# EAGLE design WiiMouseSchematicRev1 (EAGLE 5.07)

## Sheet 1 of 2
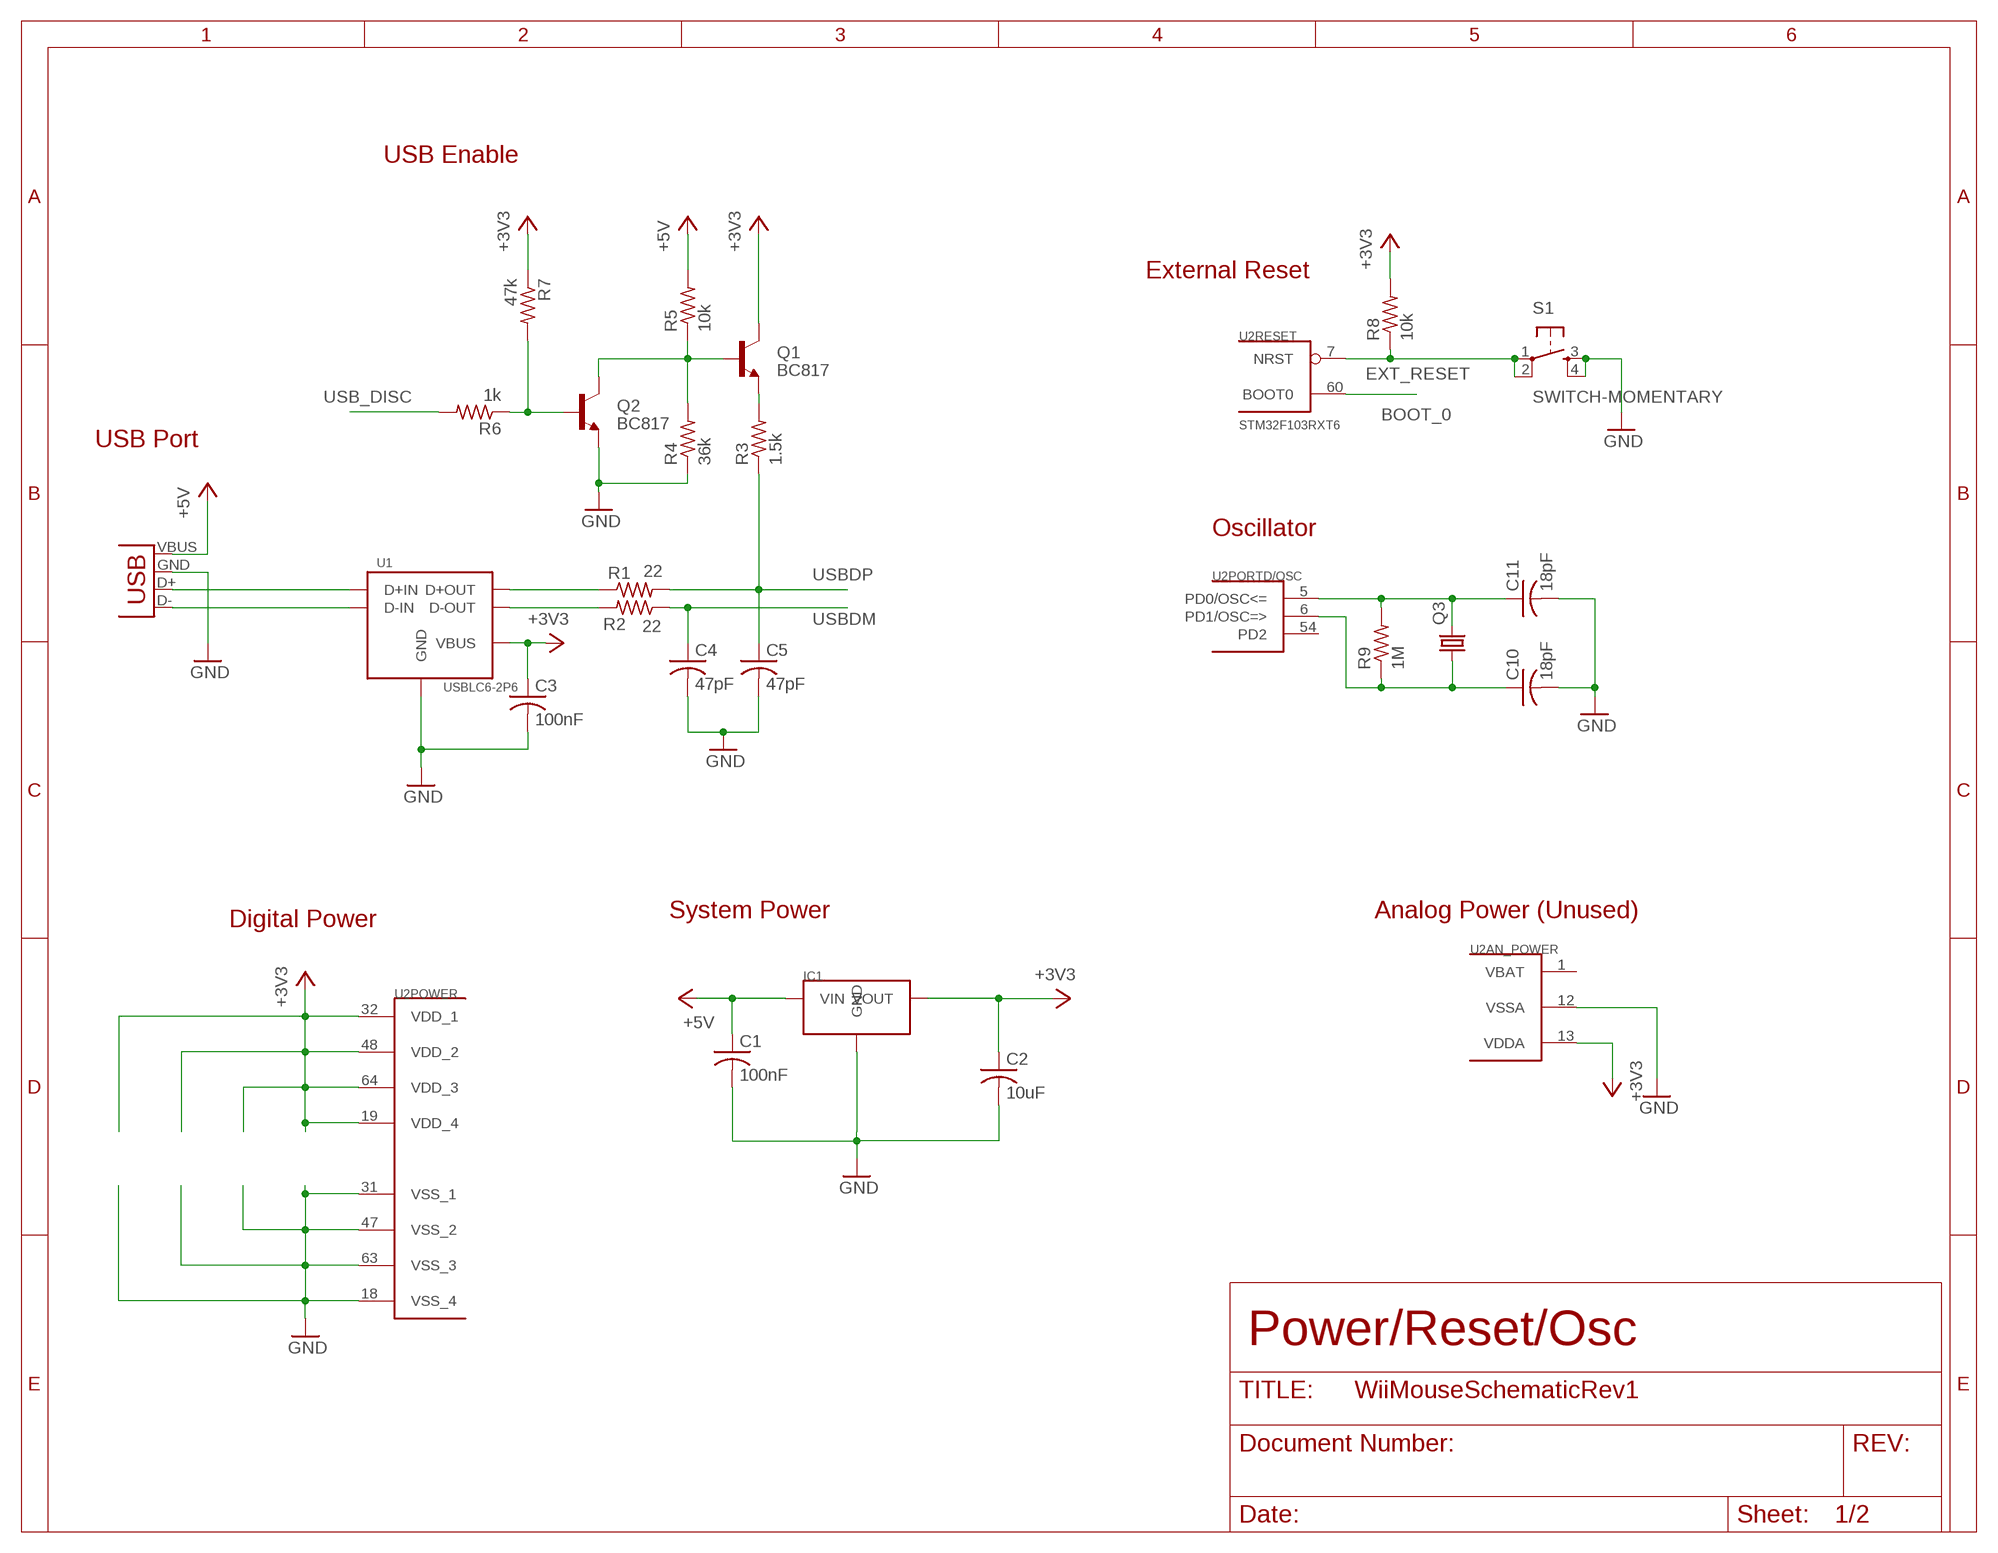
[diagram p0: schematic, sheet 1]

### Parts
C1  100nF  C-USC1206  [C1206]
C2  10uF  C-USC1206  [C1206]
C3  100nF  C-USC1206  [C1206]
C4  47pF  C-USC1206  [C1206]
C5  47pF  C-USC1206  [C1206]
C10  18pF  C-USC1206  [C1206]
C11  18pF  C-USC1206  [C1206]
IC1  LD1117  [SOT-223]
Q1  BC817  TRANSISTOR_NPNSOT23  [SOT23]
Q2  BC817  TRANSISTOR_NPNSOT23  [SOT23]
Q3  CRYSTALHC49UP  [HC49UP]
R1  22  R-US_M1206  [M1206]
R2  22  R-US_M1206  [M1206]
R3  1.5k  R-US_M1206  [M1206]
R4  36k  R-US_M1206  [M1206]
R5  10k  R-US_M1206  [M1206]
R6  1k  R-US_M1206  [M1206]
R7  47k  R-US_M1206  [M1206]
R8  10k  R-US_M1206  [M1206]
R9  1M  R-US_M1206  [M1206]
S1  SWITCH-MOMENTARY  [PUSH-BTN]
U1  USBLC6-2P6  [SOT-666]
U2  STM32F103RXT6  STM32F10XRXT6  [TQFP64]
X1  USB-A-H  [USB-A-H]

### Nets
+3V3: C2.1 C3.1 IC1.2(VOUT) Q1.3(C) R7.1 R8.2 U1.P$5(VBUS) U2.13(AN_POWER:VDDA) U2.19(POWER:VDD_4) U2.32(POWER:VDD_1) U2.48(POWER:VDD_2) U2.64(POWER:VDD_3) ; also sheet 2
+5V: C1.1 IC1.3(VIN) R5.2 X1.VBUS(GND)
BOOT_0: U2.60(RESET:BOOT0) ; also sheet 2
EXT_RESET: R8.1 S1.1 S1.2 U2.7(RESET:NRST)
GND: C1.2 C2.2 C3.2 C4.2 C5.2 C10.2 C11.2 IC1.1(GND) Q2.2(E) R4.1 S1.3 S1.4 U1.P$2(GND) U2.12(AN_POWER:VSSA) U2.18(POWER:VSS_4) U2.31(POWER:VSS_1) U2.47(POWER:VSS_2) U2.63(POWER:VSS_3) X1.GND(VBUS) ; also sheet 2
N$2: U1.P$3(D-IN) X1.D-(D+)
N$3: U1.P$1(D+IN) X1.D+(D-)
N$5: R1.1 U1.P$6(D+OUT)
N$6: R2.2 U1.P$4(D-OUT)
N$7: Q1.1(B) Q2.3(C) R4.2 R5.1
N$8: Q2.1(B) R6.1 R7.2
N$9: Q1.2(E) R3.2
N$10: C11.1 Q3.2 R9.2 U2.5(PORTD/OSC:PD0/OSC<=)
N$12: C10.1 Q3.1 R9.1 U2.6(PORTD/OSC:PD1/OSC=>)
USB_DISC: R6.2 ; also sheet 2
USBDM: C4.1 R2.1
USBDP: C5.1 R1.2 R3.1
Unconnected: U2.54(PORTD/OSC:PD2)

### Notes on the sheet
- USB Enable
- External Reset
- USB Port
- Oscillator
- System Power | Analog Power (Unused)
- Digital Power
- Power/Reset/Osc

## Sheet 2 of 2
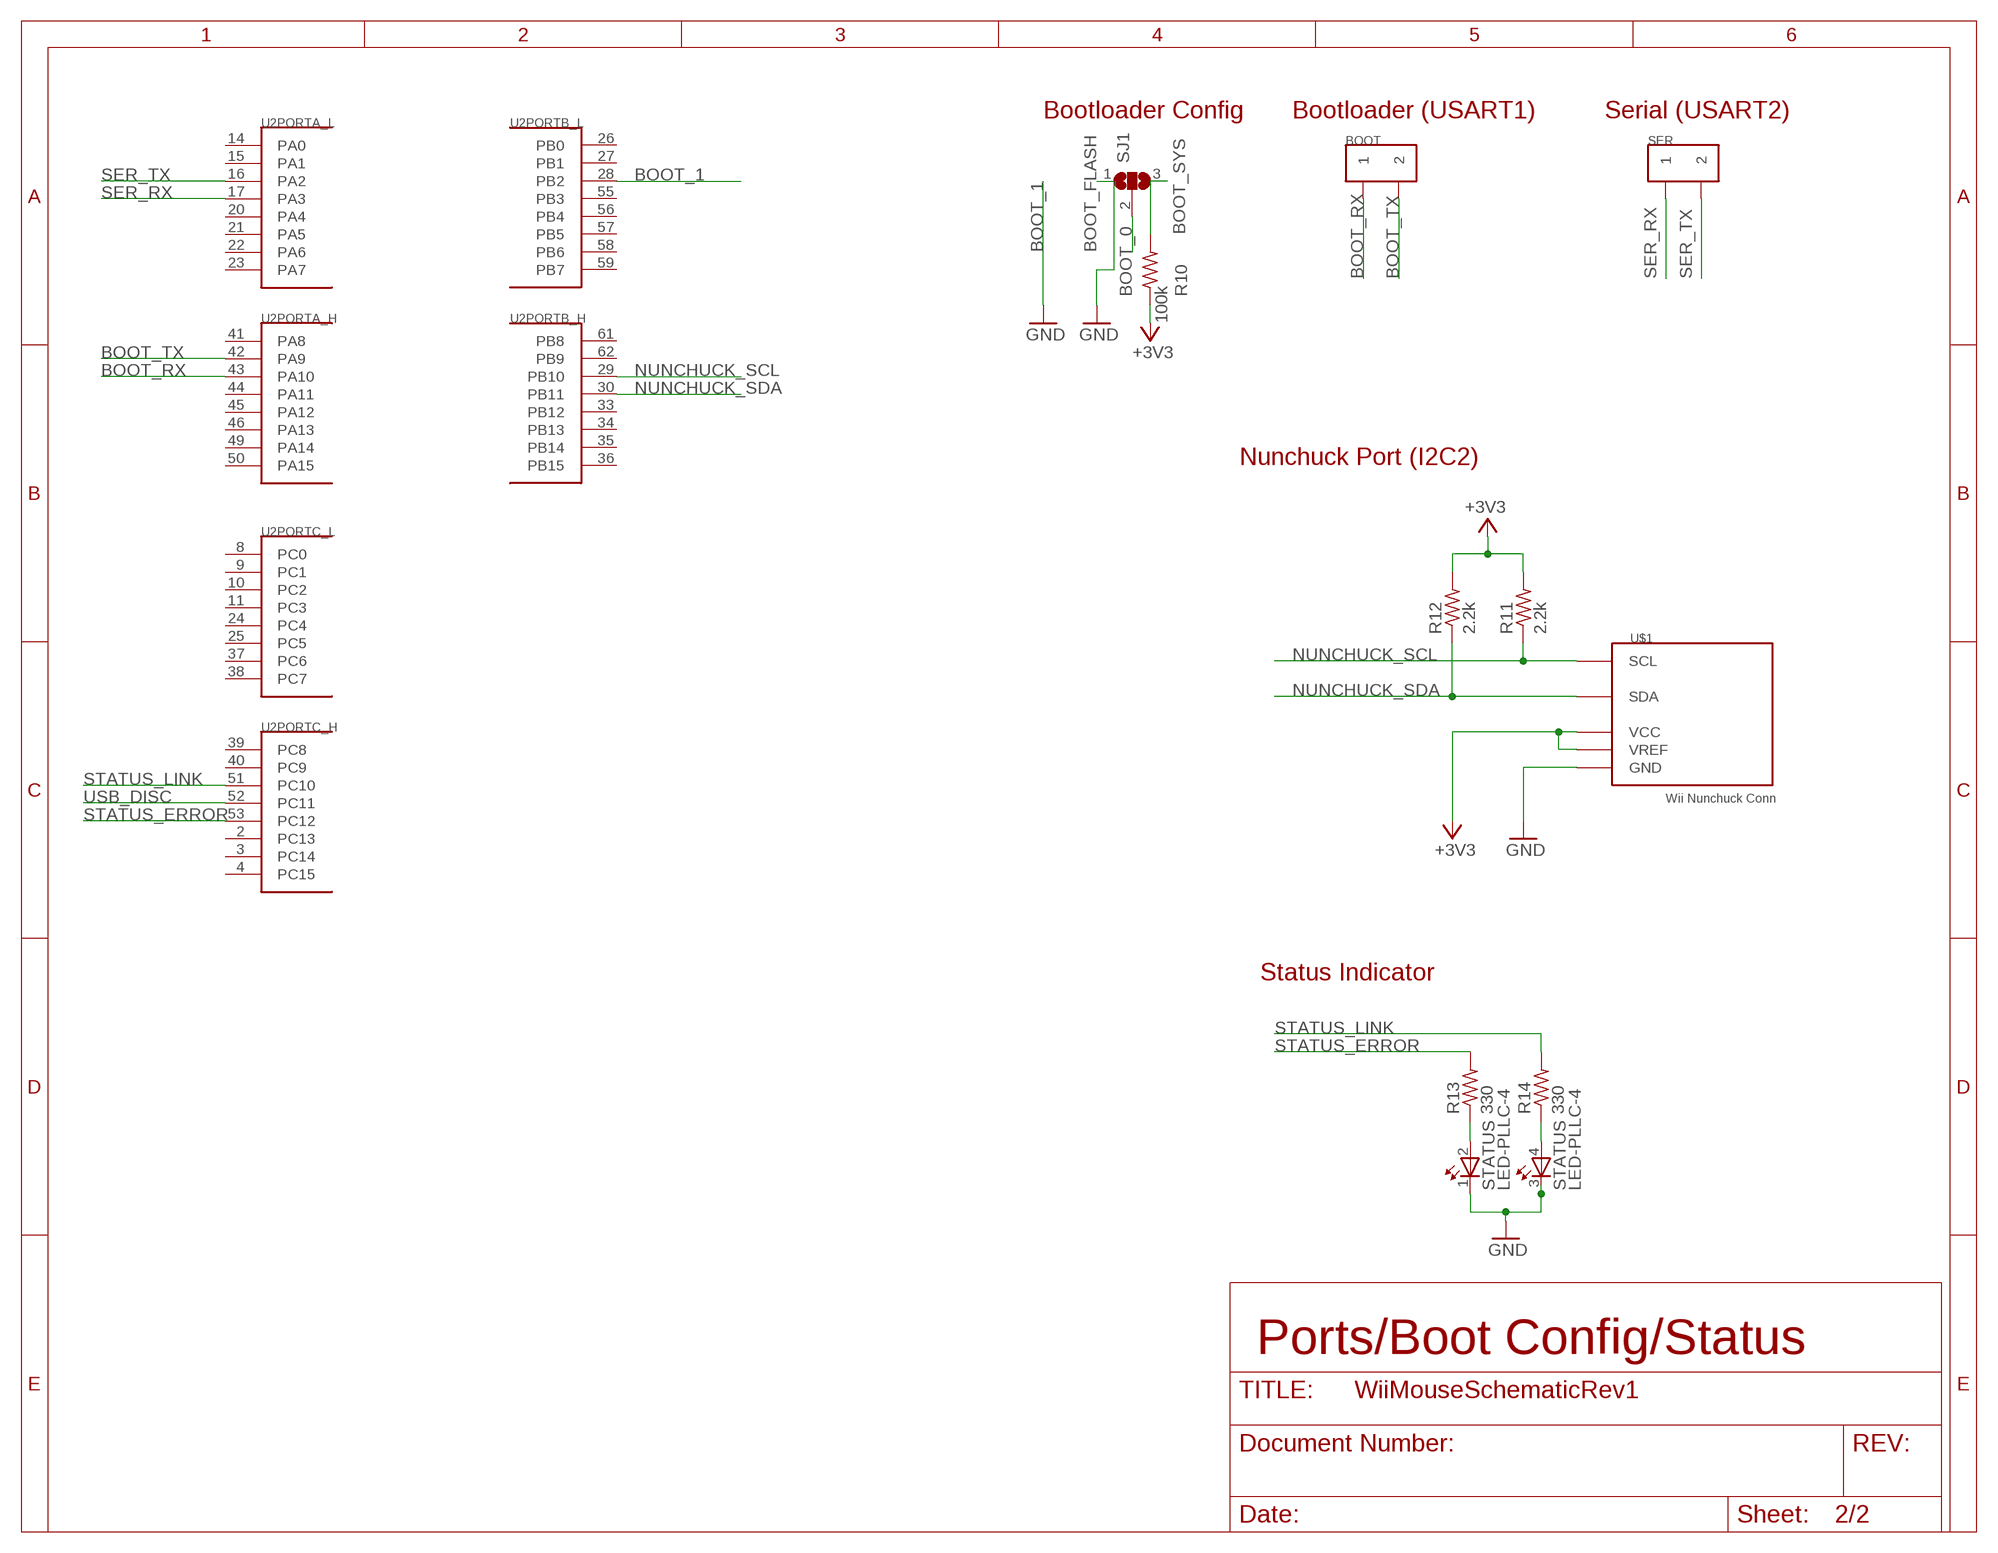
[diagram p1: schematic, sheet 2]

### Parts
BOOT  JUMPER-2-SMD  [JUMPER-2-SMD]
R10  100k  R-US_M1206  [M1206]
R11  2.2k  R-US_M1206  [M1206]
R12  2.2k  R-US_M1206  [M1206]
R13  330  R-US_M1206  [M1206]
R14  330  R-US_M1206  [M1206]
SER  JUMPER-2-SMD  [JUMPER-2-SMD]
SJ1  SJ2WW  [SJ_2W]
STATUS  LED-PLLC-4  [LED-PLCC-4]
U$1  WII-NUNCHUCK  [CONN-WII-MOUSE]

### Nets
+3V3: R10.1 R11.2 R12.2 U$1.REF_POS(VREF) U$1.VCC ; also sheet 1
BOOT_0: SJ1.2 ; also sheet 1
BOOT_1: U2.28(PORTB_L:PB2) ; supply symbol labelled GND
BOOT_RX: BOOT.P$1 U2.43(PORTA_H:PA10)
BOOT_TX: BOOT.P$2 U2.42(PORTA_H:PA9)
GND: SJ1.1 STATUS.1 STATUS.3 U$1.GND ; also sheet 1
N$1: R13.1 STATUS.2
N$4: R14.1 STATUS.4
N$11: R10.2 SJ1.3
NUNCHUCK_SCL: R11.1 U2.29(PORTB_H:PB10) U$1.SCL
NUNCHUCK_SDA: R12.1 U2.30(PORTB_H:PB11) U$1.SDA
SER_RX: SER.P$1 U2.17(PORTA_L:PA3)
SER_TX: SER.P$2 U2.16(PORTA_L:PA2)
STATUS_ERROR: R13.2 U2.53(PORTC_H:PC12)
STATUS_LINK: R14.2 U2.51(PORTC_H:PC10)
USB_DISC: U2.52(PORTC_H:PC11) ; also sheet 1
Unconnected: U2.2(PORTC_H:PC13) U2.3(PORTC_H:PC14) U2.4(PORTC_H:PC15) U2.8(PORTC_L:PC0) U2.9(PORTC_L:PC1) U2.10(PORTC_L:PC2) U2.11(PORTC_L:PC3) U2.14(PORTA_L:PA0) U2.15(PORTA_L:PA1) U2.20(PORTA_L:PA4) U2.21(PORTA_L:PA5) U2.22(PORTA_L:PA6) U2.23(PORTA_L:PA7) U2.24(PORTC_L:PC4) U2.25(PORTC_L:PC5) U2.26(PORTB_L:PB0) U2.27(PORTB_L:PB1) U2.33(PORTB_H:PB12) U2.34(PORTB_H:PB13) U2.35(PORTB_H:PB14) U2.36(PORTB_H:PB15) U2.37(PORTC_L:PC6) U2.38(PORTC_L:PC7) U2.39(PORTC_H:PC8) U2.40(PORTC_H:PC9) U2.41(PORTA_H:PA8) U2.44(PORTA_H:PA11) U2.45(PORTA_H:PA12) U2.46(PORTA_H:PA13) U2.49(PORTA_H:PA14) U2.50(PORTA_H:PA15) U2.55(PORTB_L:PB3) U2.56(PORTB_L:PB4) U2.57(PORTB_L:PB5) U2.58(PORTB_L:PB6) U2.59(PORTB_L:PB7) U2.61(PORTB_H:PB8) U2.62(PORTB_H:PB9)

### Notes on the sheet
- Serial (USART2)
- Bootloader Config | Bootloader (USART1)
- BOOT_SYS
- BOOT_FLASH
- Nunchuck Port (I2C2)
- Status Indicator
- Ports/Boot Config/Status

## Power pins joined to a net without a drawn wire
VBAT: U2.1(AN_POWER:VBAT)

## Library data of the parts
BOOT SER = parts_library:JUMPER-2-SMD
C1-C5 C10 C11 = rcl:C-US: CAPACITOR, American symbol
IC1 = parts_library:LD1117
Q1 Q2 = SparkFun:TRANSISTOR_NPN: Transistor NPN BJT configuration in SOT23 package. MMBT2222 is the common NPN we use. Double check BCE configuration again layout.
Q3 = crystal:CRYSTAL: CRYSTAL; OC_FARNELL: unknown; OC_NEWARK: unknown
R1-R14 = resistor:R-US_: RESISTOR, American symbol
S1 = parts_library:SWITCH-MOMENTARY
SJ1 = jumper:SJ2W: SMD solder JUMPER
STATUS = parts_library:LED-PLLC-4
U1 = parts_library:USBLC6-2P6
U2 = stm32:STM32F10XRXT6: STM32F101/103 64pin LQFP
U$1 = parts_library:WII-NUNCHUCK
X1 = SparkFun:USB: USB Connectors USB-B-PTH is fully proven SKU : PRT-00139 USB-miniB is fully proven SKU : PRT-00587 USB-A-PCB is untested. USB-A-H is throughly reviewed, but untested. Spark Fun Electronics SKU : PRT-00437 USB-B-SMT is throughly reviewed, but untested. Needs silkscreen touching up. USB-A-S has not been used/tested USB-MB-H has not been used/tested

## Board
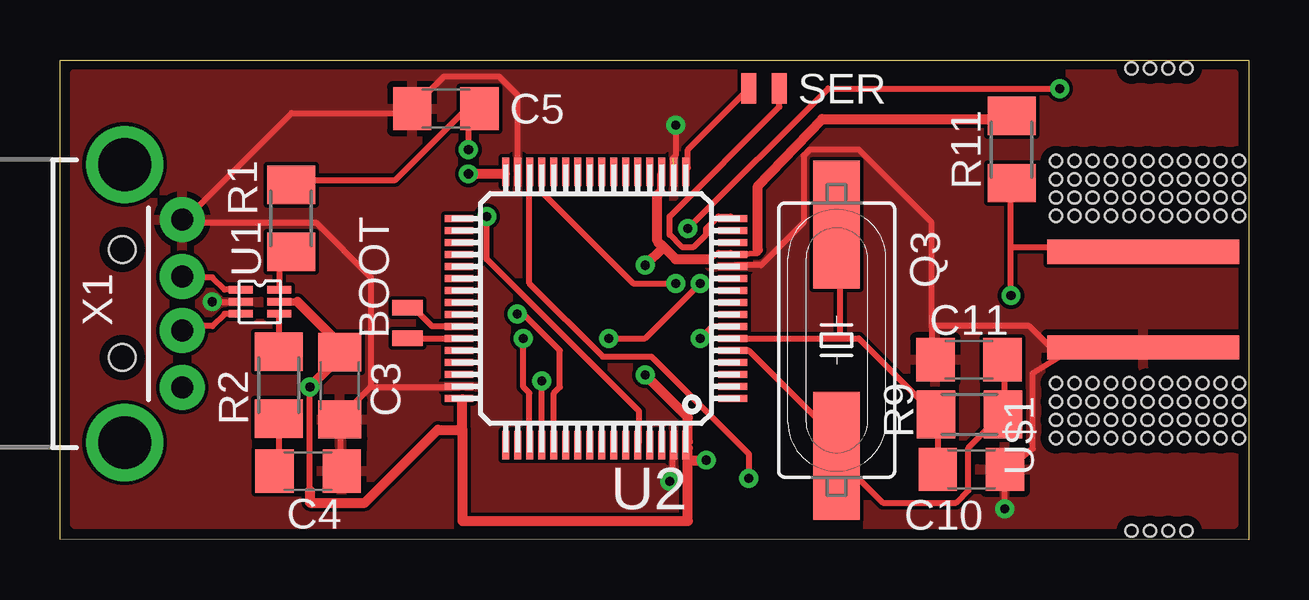
[diagram p2: board, top side]
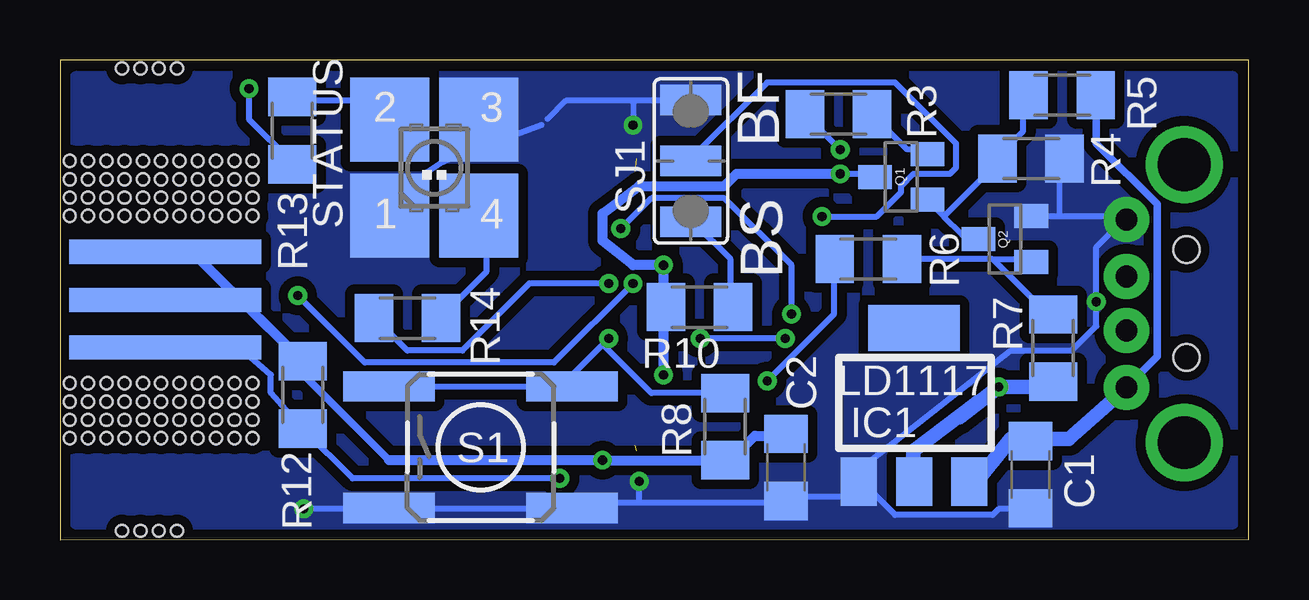
[diagram p3: board, bottom side, seen from below]

Size 49.53 x 20.02 mm. Coordinates in mm from the lower left corner, seen from the top.
Outline: 0,0.03 0,20.02 49.53,20.02 49.53,0 0,0.03
Copper layers (1*16): Top 0.0356mm / dielectric 1.5011mm / Bottom 0.0356mm
Design rules "typical_4pcb *": minimum track width 10mil, minimum drill 15mil, track to track 6mil, track to pad 6mil, pad to pad 6mil, via to via 6mil, smd to smd 6mil, copper to edge 15mil, drill to drill 10mil, minimum pad ring 10mil, minimum via ring 8mil, stop-mask expansion 4mil, vias tented up to drill 0mil, thermal gap 10mil

### Footprints (pad centres in the part's own frame; a part is rotated, then mirrored left to right if it is on the bottom)
JUMPER-2-SMD = smd 0.635 x 1.27: P$1 -1.27,0; P$2 0,0
C1206 = smd 1.6 x 1.8: 1 -1.4,0; 2 1.4,0
SOT-223 = smd 1.499 x 2.007: 1 -2.3,-3.235; 2 0,-3.235; 3 2.3,-3.235 | smd 3.81 x 1.93: 4 0,3.175
SOT23 = smd 1 x 1.4: 1 -0.95,-1.1; 2 0.95,-1.1; 3 0,1.1
HC49UP = smd 5.334 x 1.93: 1 -4.826,0; 2 4.826,0
M1206 = smd 1.6 x 2: 1 -1.4,0; 2 1.4,0
PUSH-BTN = smd 3.81 x 1.27: 1 -3.81,2.54; 2 3.81,2.54; 3 -3.81,-2.54; 4 3.81,-2.54
SJ_2W = smd 1.27 x 2.54: 1 -2.54,0; 2 0,0; 3 2.54,0
LED-PLCC-4 = smd 3.3 x 3.5: 1 -1.85,-2; 2 -1.85,2; 3 1.85,2; 4 1.85,-2
SOT-666 = smd 0.3 x 0.991: P$1 0.5,0.805; P$2 0,0.805; P$3 -0.5,0.805; P$4 -0.5,-0.805; P$5 0,-0.805; P$6 0.5,-0.805
TQFP64 = smd 1.2 x 0.3: 1 -5.7,3.75; 2 -5.7,3.25; 3 -5.7,2.75; 4 -5.7,2.25; 5 -5.7,1.75; 6 -5.7,1.25; 7 -5.7,0.75; 8 -5.7,0.25; 9 -5.7,-0.25; 10 -5.7,-0.75; 11 -5.7,-1.25; 12 -5.7,-1.75; 13 -5.7,-2.25; 14 -5.7,-2.75; 15 -5.7,-3.25; 16 -5.7,-3.75; 33 5.7,-3.75; 34 5.7,-3.25; 35 5.7,-2.75; 36 5.7,-2.25; 37 5.7,-1.75; 38 5.7,-1.25; 39 5.7,-0.75; 40 5.7,-0.25; 41 5.7,0.25; 42 5.7,0.75; 43 5.7,1.25; 44 5.7,1.75; 45 5.7,2.25; 46 5.7,2.75; 47 5.7,3.25; 48 5.7,3.75 | smd 0.3 x 1.2: 17 -3.75,-5.7; 18 -3.25,-5.7; 19 -2.75,-5.7; 20 -2.25,-5.7; 21 -1.75,-5.7; 22 -1.25,-5.7; 23 -0.75,-5.7; 24 -0.25,-5.7; 25 0.25,-5.7; 26 0.75,-5.7; 27 1.25,-5.7; 28 1.75,-5.7; 29 2.25,-5.7; 30 2.75,-5.7; 31 3.25,-5.7; 32 3.75,-5.7; 49 3.75,5.7; 50 3.25,5.7; 51 2.75,5.7; 52 2.25,5.7; 53 1.75,5.7; 54 1.25,5.7; 55 0.75,5.7; 56 0.25,5.7; 57 -0.25,5.7; 58 -0.75,5.7; 59 -1.25,5.7; 60 -1.75,5.7; 61 -2.25,5.7; 62 -2.75,5.7; 63 -3.25,5.7; 64 -3.75,5.7
CONN-WII-MOUSE = smd 1.016 x 8.001: GND 11.989,-4.394; SCL 8.001,-4.394 | smd 0.991 x 8.001 bottom: REF_POS 10.008,-4.394 | smd 1.016 x 8.001 bottom: SDA 11.989,-4.394; VCC 8.001,-4.394 | hole 0.5: 5.74,-0.406; 6.502,-0.406; 0.356,-2.591; 0.356,-4.877; 0.356,-3.353; 0.356,-4.115; 4.978,-0.406; 4.216,-0.406; 5.74,-1.168; 6.502,-1.168; 4.978,-1.168; 4.216,-1.168; 5.74,-1.93; 6.502,-1.93; 4.978,-1.93; 4.216,-1.93; 5.74,-2.692; 6.502,-2.692; 4.978,-2.692; 4.216,-2.692; 5.74,-3.454; 6.502,-3.454; 4.978,-3.454; 4.216,-3.454; 5.74,-4.216; 6.502,-4.216; 4.978,-4.216; 4.216,-4.216; 5.74,-4.978; 6.502,-4.978; 4.978,-4.978; 4.216,-4.978; 5.74,-5.74; 6.502,-5.74; 4.978,-5.74; 4.216,-5.74; 5.74,-6.502; 6.502,-6.502; 4.978,-6.502; 4.216,-6.502; 5.74,-7.264; 6.502,-7.264; 4.978,-7.264; 4.216,-7.264; 5.74,-8.026; 6.502,-8.026; 4.978,-8.026; 4.216,-8.026; 15.011,-0.406; 15.773,-0.406; 14.249,-0.406; 13.487,-0.406; 15.011,-1.168; 15.773,-1.168; 14.249,-1.168; 13.487,-1.168; 15.011,-1.93; 15.773,-1.93; 14.249,-1.93; 13.487,-1.93; 15.011,-2.692; 15.773,-2.692; 14.249,-2.692; 13.487,-2.692; 15.011,-3.454; 15.773,-3.454; 14.249,-3.454; 13.487,-3.454; 15.011,-4.216; 15.773,-4.216; 14.249,-4.216; 13.487,-4.216; 15.011,-4.978; 15.773,-4.978; 14.249,-4.978; 13.487,-4.978; 15.011,-5.74; 15.773,-5.74; 14.249,-5.74; 13.487,-5.74; 15.011,-6.502; 15.773,-6.502; 14.249,-6.502; 13.487,-6.502; 15.011,-7.264; 15.773,-7.264; 14.249,-7.264; 13.487,-7.264; 15.011,-8.026; 15.773,-8.026; 14.249,-8.026; 13.487,-8.026; 19.634,-2.591; 19.634,-4.877; 19.634,-3.353; 19.634,-4.115
USB-A-H = drill 0.914 pad 1.88 round: D+ 2.4,1.127; D- 2.4,-1.127; GND 2.4,3.5; VBUS 2.4,-3.5 | drill 2.2 round: GND2 0,-5.8; GND3 0,5.8 | hole 1.1: -0.1,2.25; -0.1,-2.25

### Placement (x,y rotation side)
BOOT  14.48,9.68 90 top
C1  9.09,2.72 270 bottom
C2  19.28,3.02 270 bottom
C3  11.66,6.43 270 top
C4  10.34,2.87 0 top
C5  16.08,17.98 180 top
C10  37.97,2.95 0 top
C11  37.87,7.52 180 top
IC1  13.94,5.66 0 bottom
Q1  14.48,15.14 90 bottom
Q2  10.16,12.55 90 bottom
Q3  32.36,8.33 270 top
R1  9.63,13.41 90 top
R2  9.12,6.45 90 top
R3  17.09,17.75 0 bottom
R4  9.07,15.9 180 bottom
R5  7.77,18.54 0 bottom
R6  15.85,11.71 180 bottom
R7  8.15,8 90 bottom
R8  21.82,4.72 270 bottom
R9  37.9,5.23 0 top
R10  22.89,9.7 0 bottom
R11  39.65,16.28 90 top
R12  39.42,6.05 90 bottom
R13  39.85,17.07 270 bottom
R14  35.05,9.25 180 bottom
S1  32,3.86 0 bottom
SER  29.97,18.82 0 top
SJ1  23.24,15.8 270 bottom
STATUS  33.93,15.52 0 bottom
U1  8.33,9.93 90 top
U2  22.33,9.65 180 top
U$1  49.53,20.02 270 top
X1  2.69,9.86 0 top

### Tracks (layer width: path | path; a pad name or v marks a point on that pad's centre or on a via)
+3V3  (via drill 0.38)
  Top 0.254: 18.54,15.27 U2.32 | 25.02,14.5 25.02,15.27 U2.19 | 27.05,11.71 27.43,11.96 27.94,11.96 U2.13 29.08,11.96 29.08,12.09 | 39.62,17.55 R11.2 | 26.16,3.84 U2.64 | 16.76,5.87 U2.48 | 11.43,8.41 11.43,7.9 C3.1 11.68,7.65 | 10.41,2.06 v10.41,6.38
  Top 0.305: 9.91,9.93 U1.P$5 | U2.64 26.16,4.09
  Top 0.406: v17.02,15.27 18.54,15.27 | 25.02,14.5 24.89,14.38 24.89,12.47 25.15,12.22 | 25.15,12.22 25.65,11.71 27.05,11.71 | v24.38,11.46 25.15,12.22 | 39.62,17.55 31.75,17.55 29.08,14.76 29.08,12.09 | 26.16,3.33 26.16,3.84 | 26.16,3.33 26.16,0.79 16.76,0.79 16.76,4.6 | 16.76,4.6 16.76,5.87 | 11.43,8.41 9.91,9.93 | v10.41,6.38 11.68,7.65 | 16.76,4.6 15.75,4.6 12.7,1.55 10.41,1.55 10.41,2.06 | 26.16,3.33 v26.92,3.33 | v24.38,6.88 26.16,5.11 26.16,4.09
  Bottom 0.254: v17.02,15.27 15.75,15.27 Q1.3 | 24.38,9.93 R10.1 24.38,9.68 | 12.06,5.11 11.3,5.74 | 19.3,4.34 C2.1 | 21.59,3.33 R8.2 21.84,3.33 | 41.91,9.93 44.96,9.93 U$1.REF_POS | R12.2 39.62,7.65 | 39.37,6.88 39.37,7.39 R12.2 | 39.47,7.52 39.37,7.65 R12.2 | 44.22,12.19 44.96,11.96 U$1.VCC | 8.51,6.38 8.38,6.38 R7.1 8.13,6.38 7.87,6.12 8.51,6.38
  Bottom 0.305: 35.81,3.33 39.37,6.88
  Bottom 0.406: 24.38,9.93 v24.38,11.46 25.65,11.46 26.92,12.47 26.92,13.61 25.4,14.76 21.84,14.76 21.34,15.27 v17.02,15.27 | 19.3,4.34 20.57,4.34 21.59,3.33 | 39.62,7.65 41.91,9.93 | 35.81,3.33 v26.92,3.33 21.84,3.33 | v24.38,6.88 24.38,9.68 | 39.47,7.52 44.22,12.19
  Bottom 0.61: 11.3,5.74 13.97,3.71 IC1.2 | 12.06,5.11 v10.41,6.38 8.51,6.38
+5V
  Bottom 0.254: 8.64,4.09 C1.1 9.4,4.22 | 11.43,2.31 IC1.3 | 6.35,18.31 R5.2 | 5.08,6.38 X1.VBUS 5.33,6.12
  Bottom 0.305: 6.35,18.31 6.35,16.54 3.81,14 3.81,7.65 5.08,6.38
  Bottom 0.61: 8.64,4.09 9.91,4.22 11.43,2.31 | 9.4,4.22 7.49,4.22 5.33,6.12
BOOT_0  (via drill 0.38)
  Top 0.254: v17.78,13.49 17.78,11.71 24.13,5.36 24.13,4.09 U2.60
  Bottom 0.254: v17.78,13.49 15.49,13.49 14.48,14.5 14.48,14.76 13.97,15.27 12.45,15.27 12.19,15.52 12.19,16.54 14.73,19.08 20.07,19.08 23.11,16.03 SJ1.2
BOOT_RX
  Top 0.254: BOOT.P$1 16.51,8.41 U2.43
BOOT_TX
  Top 0.254: BOOT.P$2 14.73,9.68 15.49,8.92 16.51,8.92 U2.42
EXT_RESET  (via drill 0.38)
  Top 0.254: v26.67,8.41 27.18,8.92 27.94,8.92 U2.7
  Bottom 0.254: 26.92,8.15 28.19,6.88 S1.2 28.19,6.38 35.81,6.38 S1.1 | 26.92,8.15 24.89,6.12 21.84,6.12 R8.1 | 26.92,8.15 v26.67,8.41
GND  (via drill 0.38)  (2 unrouted)
  Top 0.254: 25.53,15.9 25.65,16.03 v25.65,17.3 | U2.12 28.19,11.46 29.21,11.46 30.99,13.23 30.99,16.03 31.24,16.28 33.27,16.28 36.32,13.23 36.32,8.92 | C11.2 36.32,7.65 36.32,8.92 | 36.32,8.92 40.39,8.92 41.66,7.65 | 44.96,7.9 41.91,7.9 41.66,7.65 | 41.66,7.65 40.54,6.96 40.54,3.81 39.62,3.07 C10.2 39.37,2.82 v39.37,1.3 | 25.53,3.71 25.53,2.57 v25.4,2.44 | U2.31 19.05,15.52 19.05,18.57 18.29,19.33 16,19.33 14.73,18.06 C5.2 14.48,17.81 9.65,17.81 5.33,13.49 X1.GND 5.33,13.23 10.67,13.23 12.95,10.95 12.95,6.38 | v6.35,9.93 U1.P$2 | U2.47 16.51,6.38 12.95,6.38 | 12.95,6.38 11.68,5.11 C3.2 11.68,4.85 11.68,3.07 C4.2
  Bottom 0.254: SJ1.1 23.37,18.31 25.65,18.31 | 25.65,18.31 v25.65,17.3 | 25.65,18.31 28.45,18.31 29.21,17.55 | 36.32,13.23 34.21,15.34 33.55,15.77 | 29.46,17.3 33.55,15.77 | 33.55,15.77 32.26,16.54 | 35.81,1.3 v39.37,1.3 | 35.81,1.3 S1.3 | 35.81,1.3 28.19,1.3 S1.4 28.19,1.55 25.4,1.55 | 25.4,1.55 v25.4,2.44 | 25.4,1.55 19.3,1.55 C2.2 19.05,1.8 16.76,1.8 16.26,2.31 IC1.1 | IC1.1 16,2.57 16.38,2.82 9.91,7.9 7.37,7.9 6.35,8.92 v6.35,9.93 6.35,12.22 5.33,13.23 X1.GND 5.33,13.49 7.87,13.49 | R4.1 7.87,15.77 7.87,13.49 | Q2.2 8.89,13.49 7.87,13.49 | C1.2 9.14,1.3 10.41,1.3 10.67,1.04 14.73,1.04 16,2.31 IC1.1
  pour Bottom (isolate 0.406, no thermals): 0.64,19.33 48.9,19.33 48.9,0.66 0.64,0.66
  pour Top: 0.64,19.46 48.9,19.46 48.9,0.66 0.64,0.66
N$1
  Bottom 0.254: R13.1 39.88,18.31 36.32,18.31 35.56,17.55 STATUS.2
N$2
  Top 0.254: U1.P$3 7.37,9.42 6.86,9.42 6.35,8.92 5.33,8.92 X1.D-
N$3
  Top 0.254: U1.P$1 7.37,10.44 6.86,10.44 6.35,10.95 5.33,10.95 X1.D+
N$4
  Bottom 0.254: R14.1 33.53,9.42 31.75,11.2 31.75,13.49 STATUS.4
N$5
  Top 0.254: U1.P$6 9.14,11.71 9.4,11.96 R1.1
N$6
  Top 0.254: U1.P$4 9.14,9.42 9.14,7.9 R2.2
N$7
  Bottom 0.254: 12.7,13.49 13.21,14 Q1.1 | 12.7,13.49 11.94,12.73 11.43,12.73 Q2.3 | R5.1 9.4,18.31 9.4,17.04 10.41,16.03 R4.2 10.41,15.77 12.7,13.49
N$8
  Bottom 0.254: 10.67,11.71 9.14,11.71 Q2.1 | 10.67,11.71 R6.1 | 10.67,11.71 8.38,9.42 R7.2
N$9
  Bottom 0.254: Q1.2 13.46,16.28 14.22,16.28 15.49,17.55 R3.2
N$10
  Top 0.254: C11.1 39.37,7.39 39.37,5.36 R9.2 39.12,5.11 37.85,3.84 37.85,2.06 37.34,1.55 34.29,1.55 32.51,3.33 Q3.2 32.26,3.58 32.26,4.34 28.7,7.9 28.19,7.9 U2.5
N$11
  Bottom 0.254: R10.2 21.59,9.93 21.59,11.71 23.11,13.23 SJ1.3
N$12
  Top 0.254: 32.51,8.41 33.27,8.41 36.32,5.36 R9.1 36.58,5.11 36.58,3.07 C10.1 | 32.51,8.41 28.19,8.41 U2.6 | 32.51,8.41 32.51,12.98 Q3.1
NUNCHUCK_SCL  (via drill 0.38)
  Top 0.254: v25.65,10.69 23.88,10.69 20.07,14.5 20.07,15.27 U2.29 | 39.62,12.22 39.62,14.76 R11.1 | v39.62,10.19 39.62,12.22 | 39.62,12.22 44.96,12.22 U$1.SCL
  Bottom 0.254: v25.65,10.69 28.96,7.39 36.83,7.39 v39.62,10.19
NUNCHUCK_SDA  (via drill 0.38)
  Top 0.254: v28.7,2.57 28.7,3.58 24.64,7.65 22.61,7.65 19.56,10.69 19.56,15.27 U2.30
  Bottom 0.254: v28.7,2.57 37.34,2.57 39.37,4.6 R12.1 39.62,4.85 40.74,6.12 40.74,6.88 41.91,7.9 44.96,7.9 U$1.SDA
SER_RX
  Top 0.254: SER.P$1 26.16,16.28 26.16,15.52 U2.17
SER_TX
  Top 0.254: SER.P$2 29.97,18.06 25.4,13.49 25.4,12.73 25.91,12.22 26.42,12.22 26.92,12.73 26.92,12.98 27.43,13.49 27.94,13.49 U2.16
STATUS_ERROR  (via drill 0.38)
  Top 0.254: v19.05,9.42 19.3,9.42 20.83,7.9 20.83,6.38 20.57,6.12 20.57,4.09 U2.53 | v26.16,12.98 32,18.82 v41.66,18.82
  Bottom 0.254: v19.05,9.42 19.05,11.46 21.84,14.25 24.89,14.25 v26.16,12.98 | v41.66,18.82 41.66,17.55 39.88,15.77 R13.2
STATUS_LINK  (via drill 0.38)
  Top 0.254: v19.3,8.41 19.3,6.38 19.56,6.12 19.56,4.09 U2.51 | v22.86,8.41 24.38,8.41 v26.67,10.69
  Bottom 0.254: v19.3,8.41 v22.86,8.41 | v26.67,10.69 29.97,10.69 32.77,7.9 35.05,7.9 36.32,9.17 R14.2
USB_DISC  (via drill 0.38)
  Top 0.254: v20.07,6.63 20.07,4.09 U2.52
  Bottom 0.254: v20.07,6.63 17.27,9.42 17.27,11.71 R6.2
USBDM
  Top 0.254: C4.1 9.14,3.07 9.14,4.85 R2.1
USBDP  (via drill 0.38)
  Top 0.254: 17.02,17.81 16.76,17.81 13.97,15.01 9.65,15.01 R1.2 | 17.02,17.81 17.27,17.81 C5.1 17.02,17.81 | 17.02,17.81 v17.02,16.28
  Bottom 0.254: v17.02,16.28 18.29,17.55 R3.1

### Text on the board
bNames: BF | BS